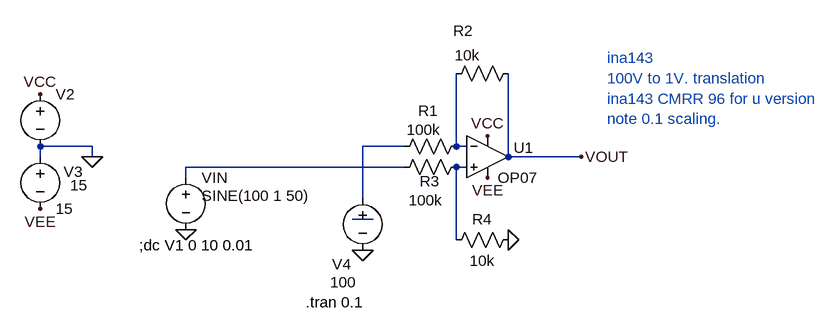
[diagram p0: schematic Draft09.asc]
Draft09.asc, the LTspice schematic file:
Version 4
SHEET 1 944 680
WIRE -192 80 -272 80
WIRE 288 80 224 80
WIRE 368 80 368 -32
WIRE 384 80 368 80
WIRE -272 96 -272 80
WIRE -192 96 -192 80
WIRE 448 96 448 -32
WIRE 560 96 448 96
WIRE 288 112 -48 112
WIRE 384 112 368 112
WIRE -48 128 -48 112
WIRE 224 160 224 80
WIRE 240 192 208 192
WIRE 368 224 368 112
FLAG -48 208 0
FLAG -192 96 0
FLAG 560 96 VOUT
FLAG 224 240 0
FLAG 448 224 0
FLAG -272 0 VCC
FLAG 416 64 VCC
FLAG -272 176 VEE
FLAG 416 128 VEE
SYMBOL voltage -48 112 R0
WINDOW 123 0 0 Left 0
WINDOW 39 0 0 Left 0
WINDOW 3 24 44 Left 2
SYMATTR Value SINE(100 1 50)
SYMATTR InstName VIN
SYMBOL OpAmps\\OP07 416 32 R0
WINDOW 0 40 50 Left 2
SYMATTR InstName U1
SYMBOL voltage -272 -16 R0
WINDOW 123 0 0 Left 0
WINDOW 39 0 0 Left 0
WINDOW 3 46 156 Left 2
SYMATTR Value 15
SYMATTR InstName V2
SYMBOL voltage -272 80 R0
WINDOW 123 0 0 Left 0
WINDOW 39 0 0 Left 0
WINDOW 0 36 39 Left 2
SYMATTR InstName V3
SYMATTR Value 15
SYMBOL res 384 64 R90
WINDOW 0 -23 59 VBottom 2
WINDOW 3 -25 66 VTop 2
SYMATTR InstName R1
SYMATTR Value 100k
SYMBOL res 464 -48 R90
WINDOW 0 -34 85 VBottom 2
WINDOW 3 -28 79 VTop 2
SYMATTR InstName R2
SYMATTR Value 10k
SYMBOL voltage 224 144 R0
WINDOW 0 -47 117 Left 2
WINDOW 3 -50 145 Left 2
WINDOW 123 0 0 Left 0
WINDOW 39 0 0 Left 0
SYMATTR InstName V4
SYMATTR Value 100
SYMBOL res 384 96 R90
WINDOW 0 53 57 VBottom 2
WINDOW 3 51 63 VTop 2
SYMATTR InstName R3
SYMATTR Value 100k
SYMBOL res 464 208 R90
WINDOW 0 0 56 VBottom 2
WINDOW 3 32 56 VTop 2
SYMATTR InstName R4
SYMATTR Value 10k
TEXT -120 232 Left 2 !;dc V1 0 10 0.01
TEXT 136 320 Left 2 !.tran 0.1
TEXT 600 -56 Left 2 ;ina143\n100V to 1V. translation\nina143 CMRR 96 for u version\nnote 0.1 scaling.

The netlist it stands for:
* Draft09.asc
VIN N003 0 SINE(100 1 50)
XU1 N004 N002 VCC VEE VOUT LT1001  ; OP07, pins In+ In- V+ V- OUT
V2 VCC 0 15
V3 0 VEE 15
R1 N002 N001 100k
R2 VOUT N002 10k
V4 N001 0 100
R3 N004 N003 100k
R4 0 N004 10k
;dc V1 0 10 0.01
.tran 0.1
* ina143
* 100V to 1V. translation
* ina143 CMRR 96 for u version
* note 0.1 scaling.
.lib LTC.lib
.backanno
.end